# Altium schematic sheet JTAG_VOLT_TRNS.SchDoc
size A3
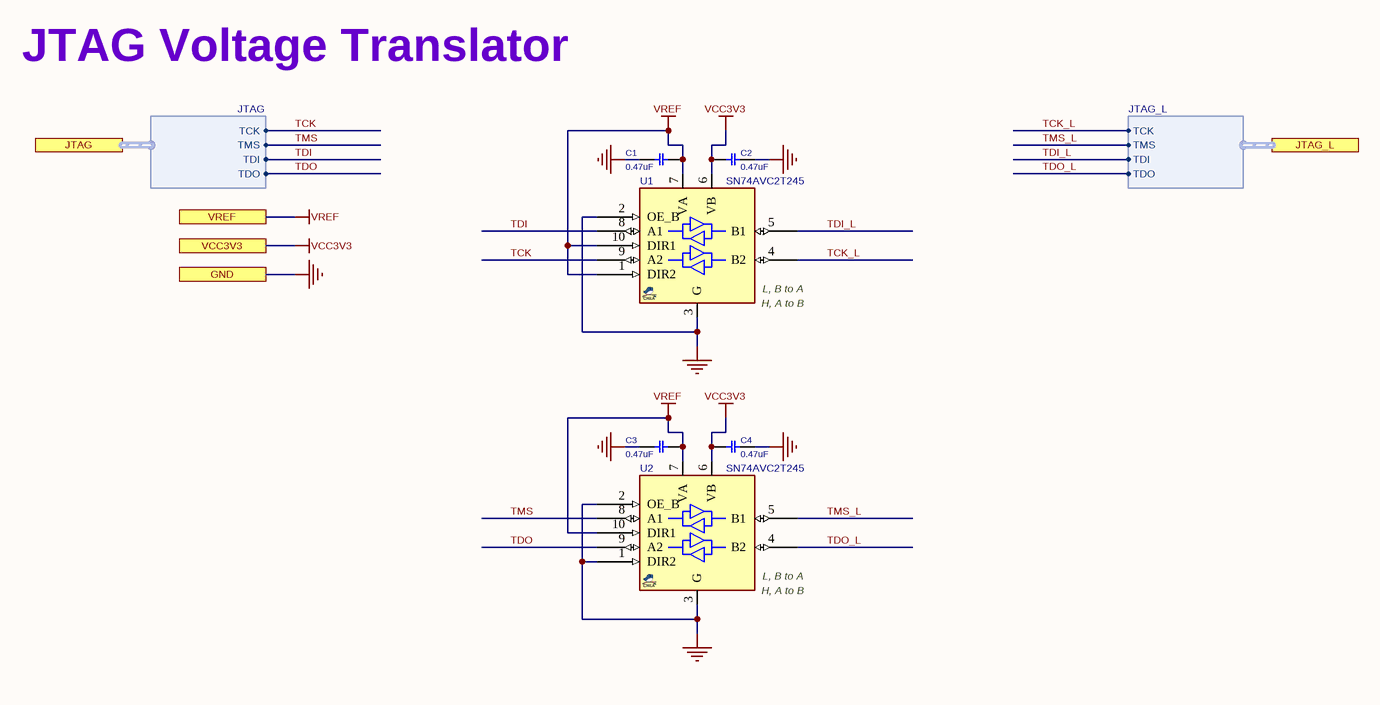
[diagram p0: JTAG_VOLT_TRNS.SchDoc]

## Parts
C1  0.47uF  [C0402]
C2  0.47uF  [C0402]
C3  0.47uF  [C0402]
C4  0.47uF  [C0402]
U1  SN74AVC2T245  [QFN40_10_1418]
U2  SN74AVC2T245  [QFN40_10_1418]

## Ports
GND, JTAG (harness JTAG), JTAG_L (harness JTAG_L), VCC3V3, VREF

## Harnesses
JTAG: TCK, TMS, TDI, TDO
JTAG_L: TCK, TMS, TDI, TDO

## Nets
GND: C1.2 C2.1 C3.2 C4.1 U1.2(OE_B) U1.3(G) U2.1(DIR2) U2.2(OE_B) U2.3(G) ; port GND
VCC3V3: C2.2 C4.2 U1.6(VB) U2.6(VB) ; port VCC3V3
VREF: C1.1 C3.1 U1.1(DIR2) U1.7(VA) U1.10(DIR1) U2.7(VA) U2.10(DIR1) ; port VREF
TCK: U1.9(A2) ; port JTAG.TCK
TCK_L: U1.4(B2) ; port JTAG_L.TCK
TDI: U1.8(A1) ; port JTAG.TDI
TDI_L: U1.5(B1) ; port JTAG_L.TDI
TDO: U2.9(A2) ; port JTAG.TDO
TDO_L: U2.4(B2) ; port JTAG_L.TDO
TMS: U2.8(A1) ; port JTAG.TMS
TMS_L: U2.5(B1) ; port JTAG_L.TMS

## Notes on the sheet
- JTAG Voltage Translator
- (near U1) H, A to B
- (near U1) L, B to A
- (near U2) H, A to B
- (near U2) L, B to A
- Title
- Size:
- Date:
- A3
- Number:
- Time:
- Revision:
- Sheet
- of
- File:

## Library data of the parts
C1-C4 = CAP_SMD_MLCC_100n50TDK: CAP, MLCC, 100nF, 50V, X7R, 10%, 0402C; PARAM: X7R, 10%, -55~125oC; MANF_P#: GCM155R71H104KE02D; MANF: Murata; PARAM2: 50V; ASSEMBLY: ASSEMBLY; PRICE: 100= 4$; VALUE: 0.47uF
U1 U2 = SN74AVC2T245_PUQFN: Level Translator, Dual, 3State; MANF: TEXAS INSTRUMENTS; MANF_P#: SN74AVC2T245RSWR; PRICE: 0.6$; VALUE: SN74AVC2T245